# Altium schematic sheet wwfe.SchDoc
size Tabloid; SheetNumber: 1; SheetTotal: 1; Sheet_Name: PLEIADES MAIN; Size: 11x17
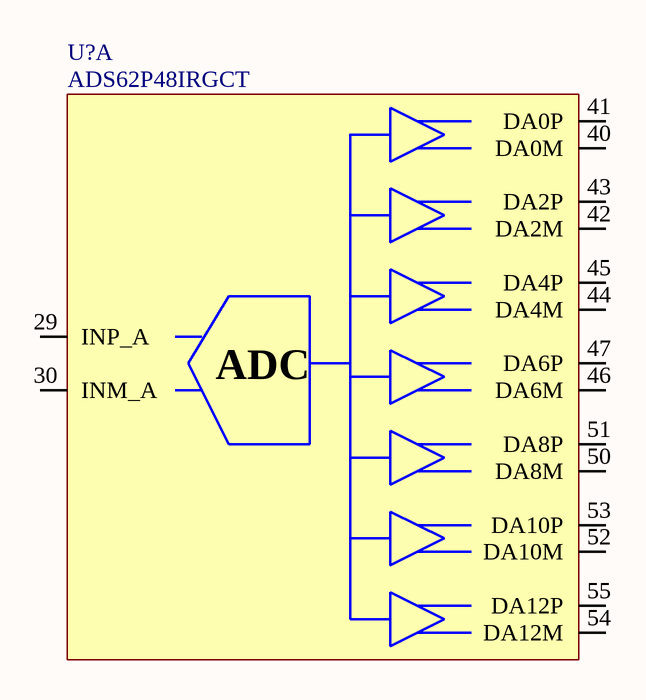
[diagram p0: wwfe.SchDoc]

## Parts
U?  ADS62P48IRGCT  [ADC_ADS62P48IRGCT]  (part A of 4)

## Nets

Not connected (* = marked no-connect by the designer): U? 29(INP_A) 30(INM_A) 40(DA0M) 41(DA0P) 42(DA2M) 43(DA2P) 44(DA4M) 45(DA4P) 46(DA6M) 47(DA6P) 50(DA8M) 51(DA8P) 52(DA10M) 53(DA10P) 54(DA12M) 55(DA12P)

## Notes on the sheet
- Sheet Name
- Project Title
- Global Project
- Size
- Group
- Revision
- Date
- Sheet
- of
- Filename
- Designers
- (in symbol ADC_ADS62P48IRGCT, part A) ADC

## Library data of the parts
U? = ADC_ADS62P48IRGCT: ADC - 14 BIT 210MSPS SUAL - VQFN-64; Voltage: 3.15 V ~ 3.6 V / 1.7 V ~ 1.9 V; Mfg: Texas Instruments; Precision: 14 Bit; Current: *; Power: *; Mfg Part Number: ADS62P48IRGCT; HelpURL: http://www.ti.com/lit/ds/symlink/ads62p48.pdf; CreatedBy: Jonathan Bouchard; Temperature: -40°C ~ 85°C; Value: *; Package: VQFN-64; Supplier 1: Digikey; Supplier Part Number 1: 296-24611-1-ND